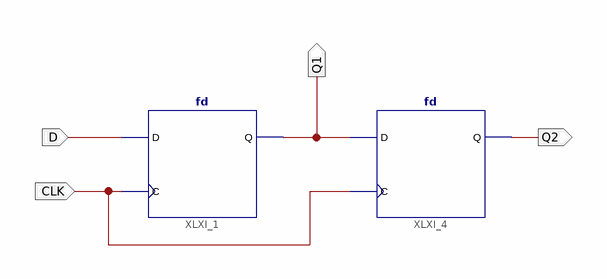
[diagram p0: schematic sheet 1]
// Xilinx ISE schematic SHIFTER.sch (spartan6) as structural Verilog: 2 symbols, 4 ports
module SHIFTER (
  input  D,
  input  CLK,
  output Q1,
  output Q2
);

  fd XLXI_1 (.C(CLK), .D(D), .Q(Q1));
  fd XLXI_4 (.C(CLK), .D(Q1), .Q(Q2));
endmodule
